# EAGLE schematic SKETCHES (EAGLE 7.5.0)
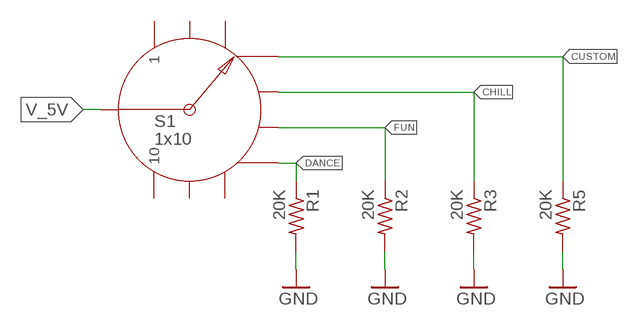
[diagram p0: schematic, sheet 1]

## Parts
R1  20K  R-US_R0805  [R0805]
R2  20K  R-US_R0805  [R0805]
R3  20K  R-US_R0805  [R0805]
R5  20K  R-US_R0805  [R0805]
S1  1x10  SWITCH_ROTARY_1X10  [ROTARY_SWITCH_1X10]

## Nets
CHILL: R3.1 S1.5
CUSTOM: R5.1 S1.4
DANCE: R1.1 S1.7
FUN: R2.1 S1.6
GND: R1.2 R2.2 R3.2 R5.2
V_5V: S1.COMMON
Unconnected: S1.1 S1.2 S1.3 S1.8 S1.9 S1.10

## Library data of the parts
R1-R3 R5 = adafruit:R-US_: RESISTOR, American symbol
S1 = SparkFun-Electromechanical:SWITCH_ROTARY_1X10: SWCH-12120; PROD_ID: SWCH-12120

## Net classes
0 default: width 0.254 mm